# Altium schematic sheet 08_IO.SchDoc
size A4
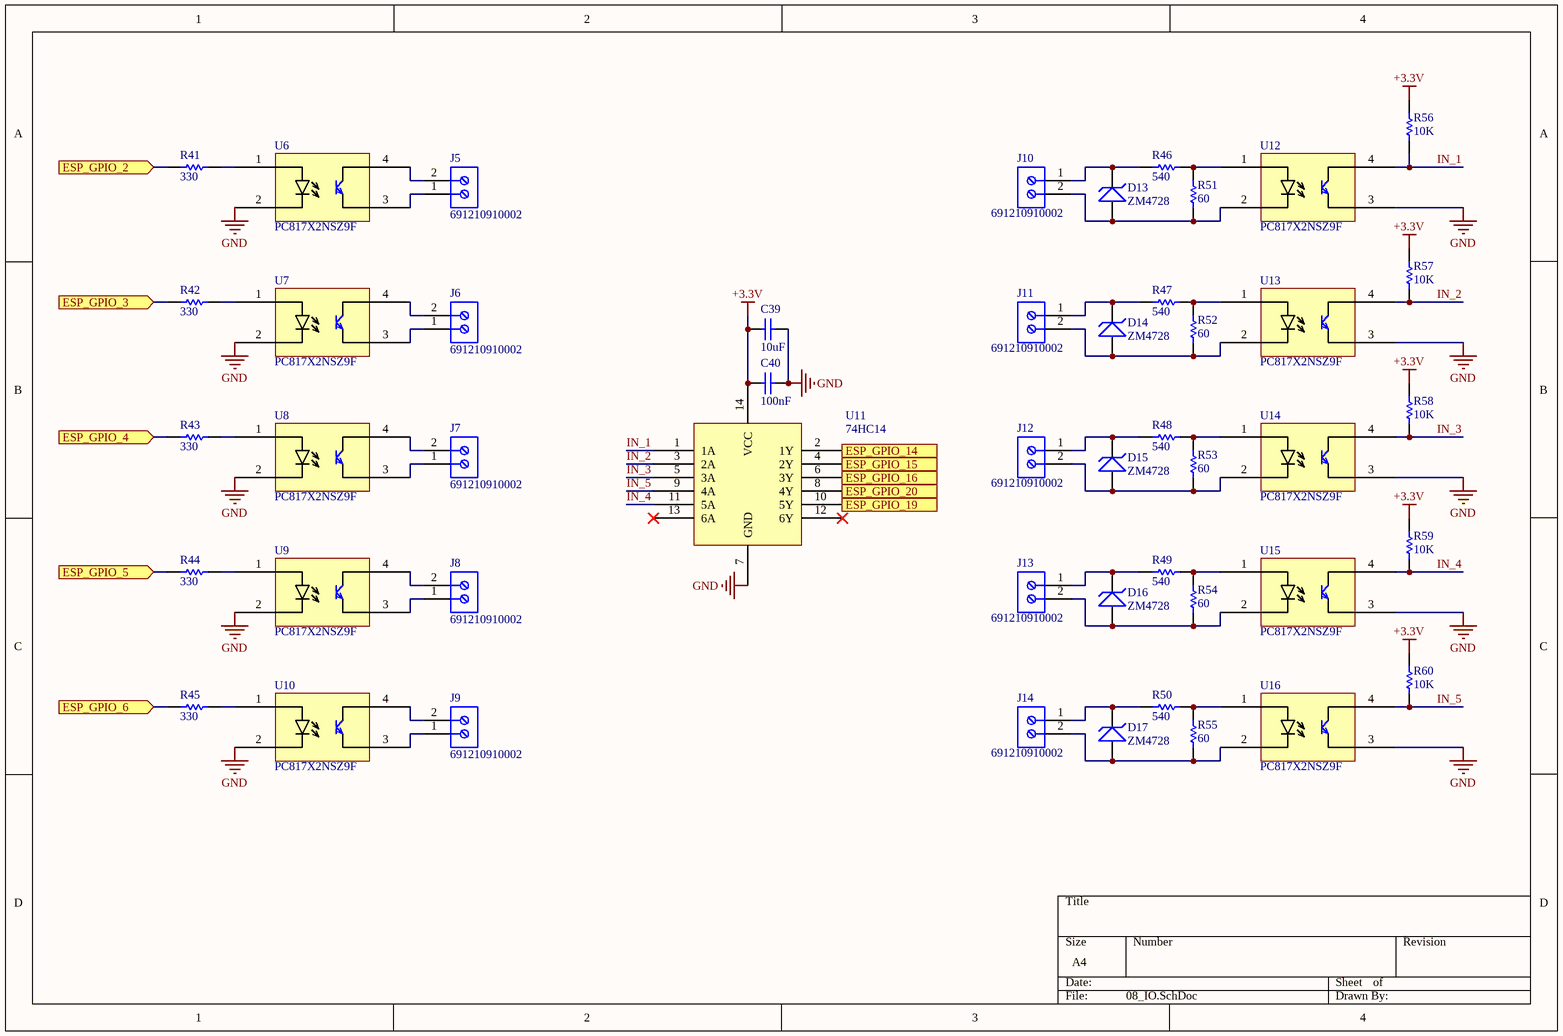
[diagram p0: 08_IO.SchDoc]

## Parts
C39  value 10uF  [C0402]  (hidden comment: Capacitor)
C40  value 100nF  [C0402]  (hidden comment: Capacitor)
D13  ZM4728  [DIOMELF3515N]
D14  ZM4728  [DIOMELF3515N]
D15  ZM4728  [DIOMELF3515N]
D16  ZM4728  [DIOMELF3515N]
D17  ZM4728  [DIOMELF3515N]
J5  691210910002  [691210910002]
J6  691210910002  [691210910002]
J7  691210910002  [691210910002]
J8  691210910002  [691210910002]
J9  691210910002  [691210910002]
J10  691210910002  [691210910002]
J11  691210910002  [691210910002]
J12  691210910002  [691210910002]
J13  691210910002  [691210910002]
J14  691210910002  [691210910002]
R41  value 330  [R0402]  (hidden comment: Resistor)
R42  value 330  [R0402]  (hidden comment: Resistor)
R43  value 330  [R0402]  (hidden comment: Resistor)
R44  value 330  [R0402]  (hidden comment: Resistor)
R45  value 330  [R0402]  (hidden comment: Resistor)
R46  value 540  [R0402]  (hidden comment: Resistor)
R47  value 540  [R0402]  (hidden comment: Resistor)
R48  value 540  [R0402]  (hidden comment: Resistor)
R49  value 540  [R0402]  (hidden comment: Resistor)
R50  value 540  [R0402]  (hidden comment: Resistor)
R51  value 60  [R0402]  (hidden comment: Resistor)
R52  value 60  [R0402]  (hidden comment: Resistor)
R53  value 60  [R0402]  (hidden comment: Resistor)
R54  value 60  [R0402]  (hidden comment: Resistor)
R55  value 60  [R0402]  (hidden comment: Resistor)
R56  value 10K  [R0402]  (hidden comment: Resistor)
R57  value 10K  [R0402]  (hidden comment: Resistor)
R58  value 10K  [R0402]  (hidden comment: Resistor)
R59  value 10K  [R0402]  (hidden comment: Resistor)
R60  value 10K  [R0402]  (hidden comment: Resistor)
U6  PC817X2NSZ9F  [PC817X2NSZ9F]
U7  PC817X2NSZ9F  [PC817X2NSZ9F]
U8  PC817X2NSZ9F  [PC817X2NSZ9F]
U9  PC817X2NSZ9F  [PC817X2NSZ9F]
U10  PC817X2NSZ9F  [PC817X2NSZ9F]
U11  74HC14  [SOIC108P600X170-14N]
U12  PC817X2NSZ9F  [PC817X2NSZ9F]
U13  PC817X2NSZ9F  [PC817X2NSZ9F]
U14  PC817X2NSZ9F  [PC817X2NSZ9F]
U15  PC817X2NSZ9F  [PC817X2NSZ9F]
U16  PC817X2NSZ9F  [PC817X2NSZ9F]

## Ports
ESP_GPIO_2 (in), ESP_GPIO_3 (in), ESP_GPIO_4 (in), ESP_GPIO_5 (in), ESP_GPIO_6 (in), ESP_GPIO_14 (out), ESP_GPIO_15 (out), ESP_GPIO_16 (out), ESP_GPIO_19 (out), ESP_GPIO_20 (out)

## Nets
+3.3V: C39.1 C40.1 R56.2 R57.2 R58.2 R59.2 R60.2 U11.14(VCC)
GND: C39.2 C40.2 U6.2(CATHODE) U7.2(CATHODE) U8.2(CATHODE) U9.2(CATHODE) U10.2(CATHODE) U11.7(GND) U12.3(CATHODE) U13.3(CATHODE) U14.3(CATHODE) U15.3(CATHODE) U16.3(CATHODE)
ESP_GPIO_2: R41.1 ; port ESP_GPIO_2
ESP_GPIO_3: R42.1 ; port ESP_GPIO_3
ESP_GPIO_4: R43.1 ; port ESP_GPIO_4
ESP_GPIO_5: R44.1 ; port ESP_GPIO_5
ESP_GPIO_6: R45.1 ; port ESP_GPIO_6
ESP_GPIO_14: U11.2(1Y) ; port ESP_GPIO_14
ESP_GPIO_15: U11.4(2Y) ; port ESP_GPIO_15
ESP_GPIO_16: U11.6(3Y) ; port ESP_GPIO_16
ESP_GPIO_19: U11.10(5Y) ; port ESP_GPIO_19
ESP_GPIO_20: U11.8(4Y) ; port ESP_GPIO_20
IN_1: R56.1 U11.1(1A) U12.4(CATHODE)
IN_2: R57.1 U11.3(2A) U13.4(CATHODE)
IN_3: R58.1 U11.5(3A) U14.4(CATHODE)
IN_4: R59.1 U11.11(5A) U15.4(CATHODE)
IN_5: R60.1 U11.9(4A) U16.4(CATHODE)
NetD13_1: D13.1 J10.1 R46.1
NetD13_2: D13.2 J10.2 R51.1 U12.2(CATHODE)
NetD14_1: D14.1 J11.1 R47.1
NetD14_2: D14.2 J11.2 R52.1 U13.2(CATHODE)
NetD15_1: D15.1 J12.1 R48.1
NetD15_2: D15.2 J12.2 R53.1 U14.2(CATHODE)
NetD16_1: D16.1 J13.1 R49.1
NetD16_2: D16.2 J13.2 R54.1 U15.2(CATHODE)
NetD17_1: D17.1 J14.1 R50.1
NetD17_2: D17.2 J14.2 R55.1 U16.2(CATHODE)
NetJ5_1: J5.1 U6.3(CATHODE)
NetJ5_2: J5.2 U6.4(CATHODE)
NetJ6_1: J6.1 U7.3(CATHODE)
NetJ6_2: J6.2 U7.4(CATHODE)
NetJ7_1: J7.1 U8.3(CATHODE)
NetJ7_2: J7.2 U8.4(CATHODE)
NetJ8_1: J8.1 U9.3(CATHODE)
NetJ8_2: J8.2 U9.4(CATHODE)
NetJ9_1: J9.1 U10.3(CATHODE)
NetJ9_2: J9.2 U10.4(CATHODE)
NetR41_2: R41.2 U6.1(ANOTHE)
NetR42_2: R42.2 U7.1(ANOTHE)
NetR43_2: R43.2 U8.1(ANOTHE)
NetR44_2: R44.2 U9.1(ANOTHE)
NetR45_2: R45.2 U10.1(ANOTHE)
NetR46_2: R46.2 R51.2 U12.1(ANOTHE)
NetR47_2: R47.2 R52.2 U13.1(ANOTHE)
NetR48_2: R48.2 R53.2 U14.1(ANOTHE)
NetR49_2: R49.2 R54.2 U15.1(ANOTHE)
NetR50_2: R50.2 R55.2 U16.1(ANOTHE)

Not connected (* = marked no-connect by the designer): U11 12(6Y)* 13(6A)*

## Library data of the parts
J5-J14 = 691210910002: WR-TBL Serie 2109 Horizontal Entry, Rising Cage Clamp, pitch 2.54mm, 2p; Compliance: Lead free / RoHS; Modularity: No; PCB/Cable/Panel: PCB; Pin Number: 2; Rated Current [UL]: 6A; Working Voltage [UL]: 150VAC; ComponentLink1Description: Manufacturer; ComponentLink1URL: http://www.we-online.de; ComponentLink2URL: https://katalog.we-online.de/em/datasheet/691210910002.pdf; ComponentLink2Description: Datasheet; Mounting Technology: THT; Part Number: 691210910002; Packaging: Box; Operating Temperature: -40 to +105degC; Pitch: 2.54mm; Published Date: October 2019; Type: Horizontal; Publisher: Wurth Elektronik; Application: Rising Cage Clamp